# EAGLE design Motor_Driver_Play (EAGLE 7.4.0)
DATABASE: C:\EAGLE-7.2.0\ulp\bom-ex164
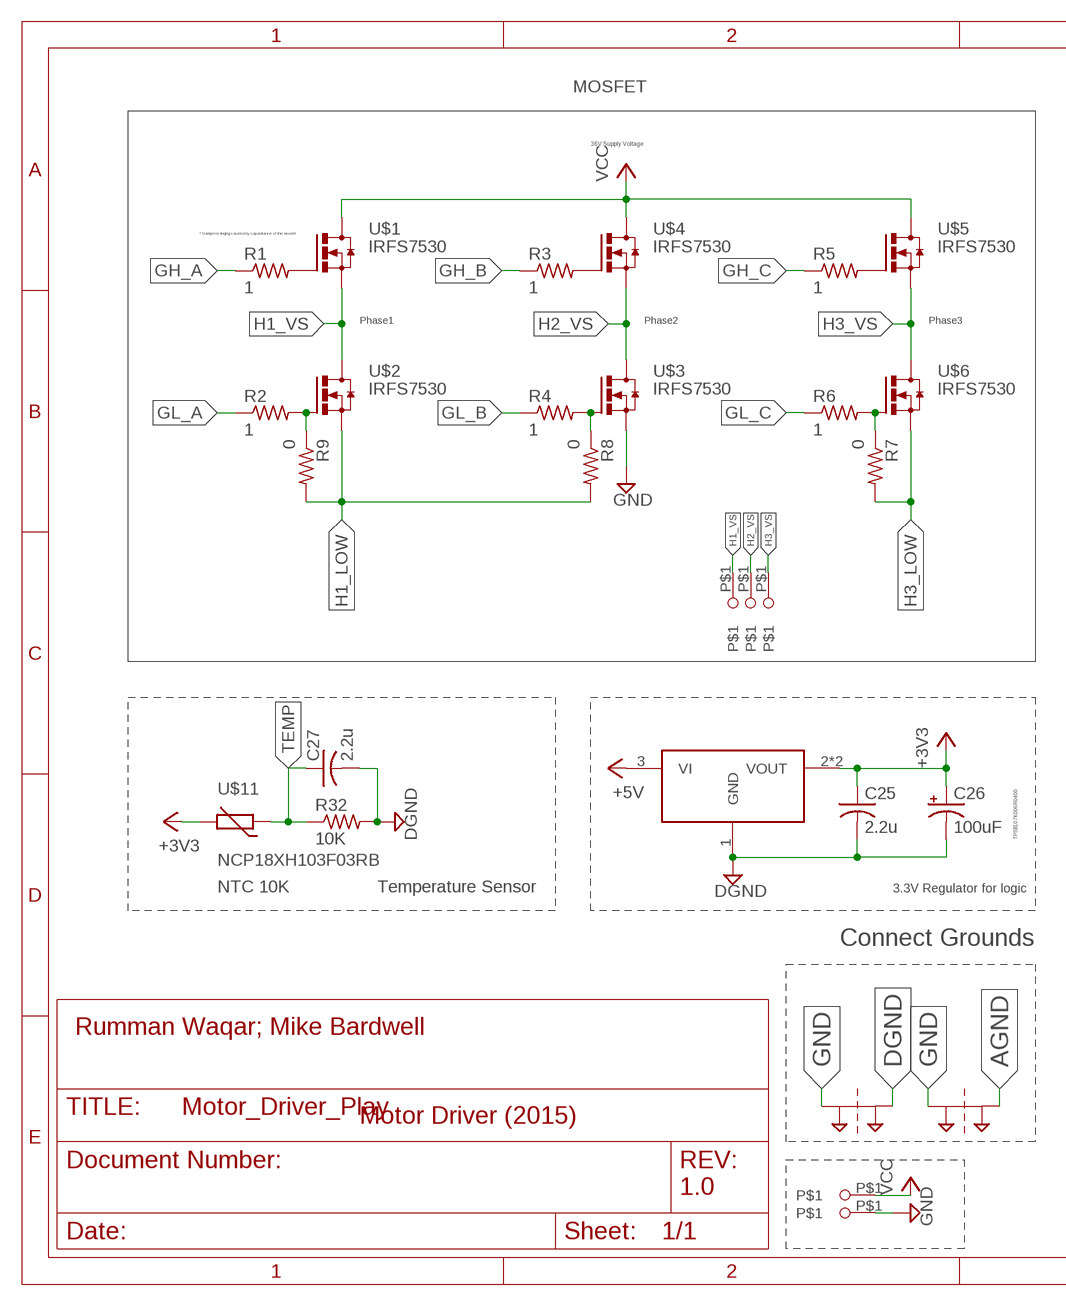
[diagram p0: schematic, sheet 1, part 1 of 2]
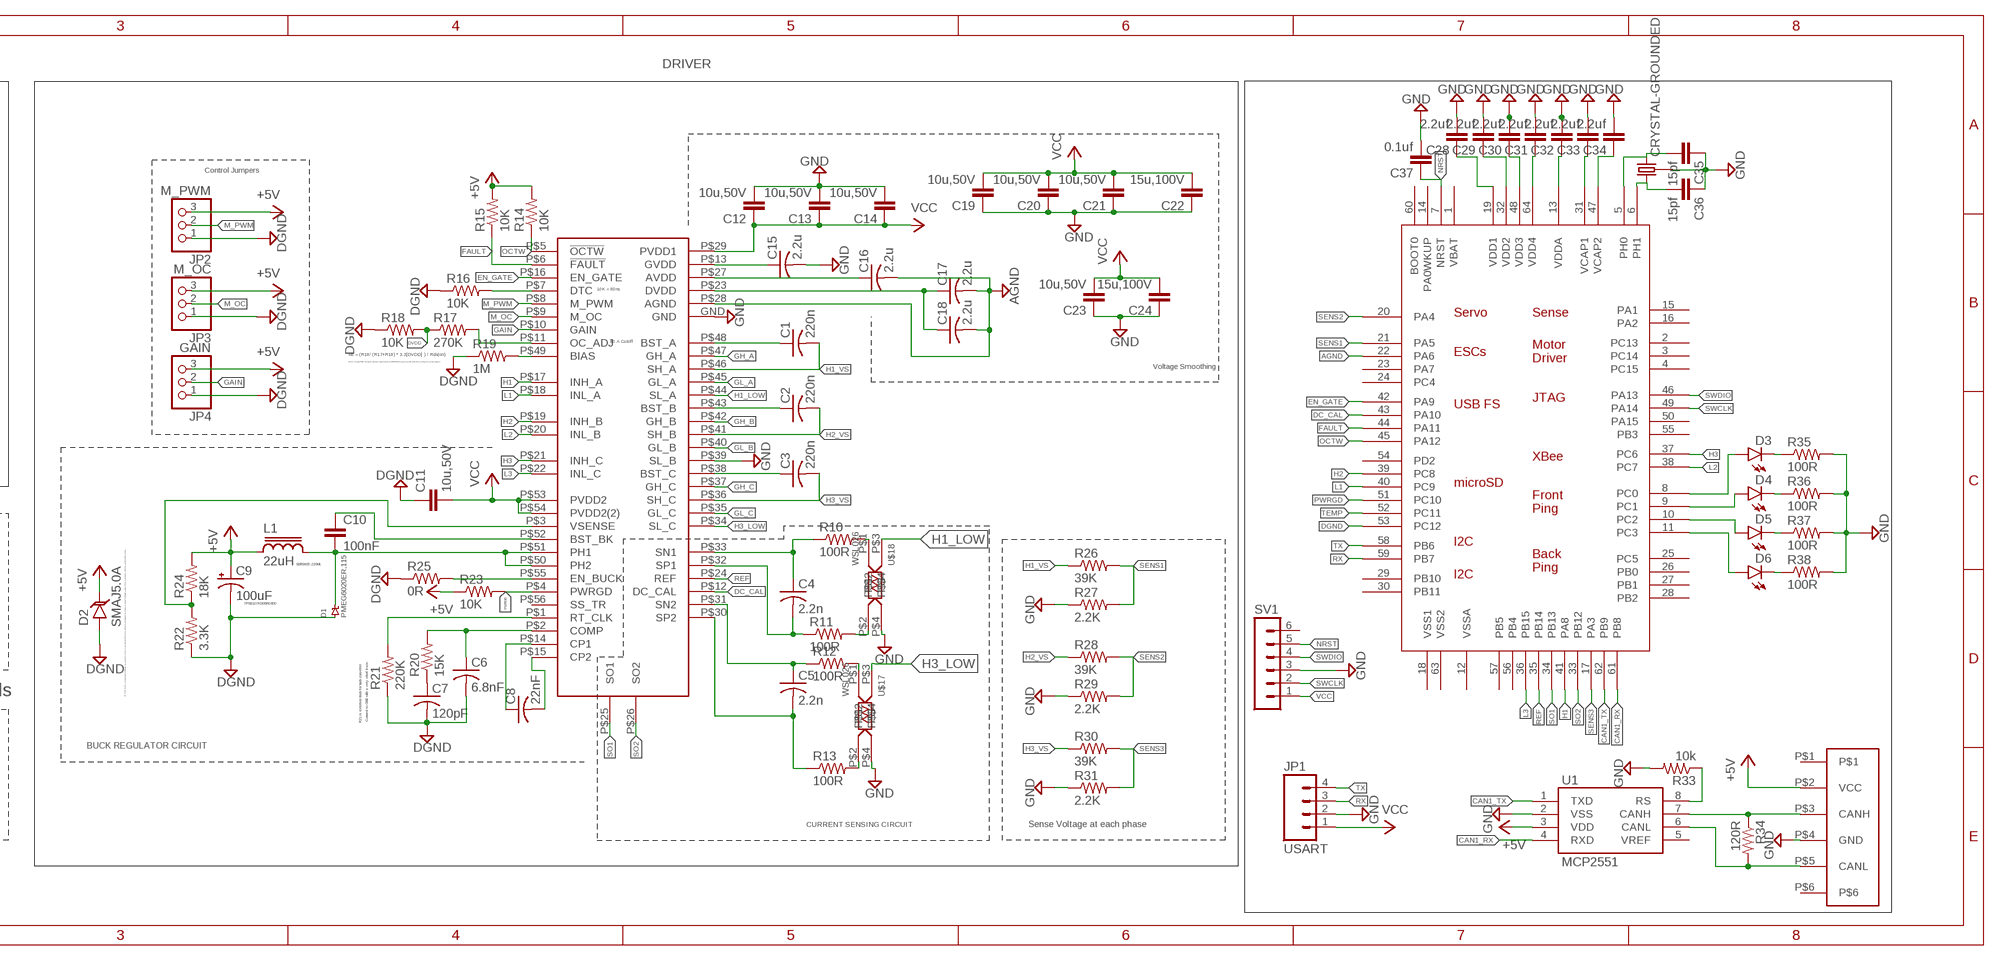
[diagram p1: schematic, sheet 1, part 2 of 2]

## Parts
C1  220n  C-USC0805  [C0805]
C2  220n  C-USC0805  [C0805]
C3  220n  C-USC0805  [C0805]
C4  2.2n  C-USC0603  [C0603]
C5  2.2n  C-USC0603  [C0603]
C6  6.8nF  C-USC0603  [C0603]
C7  120pF  C-USC0603  [C0603]
C8  22nF  C-USC0603  [C0603]
C9  100uF  CAP_POL3528-KIT  [EIA3528-KIT]
C10  100nF  CAP0805  [0805]
C11  10u,50V  CAP1206  [1206]
C12  10u,50V  CAP1206  [1206]
C13  10u,50V  CAP1206  [1206]
C14  10u,50V  CAP1206  [1206]
C15  2.2u  C-USC0805  [C0805]
C16  2.2u  C-USC0805  [C0805]
C17  2.2u  C-USC0805  [C0805]
C18  2.2u  C-USC0805  [C0805]
C19  10u,50V  CAP1206  [1206]
C20  10u,50V  CAP1206  [1206]
C21  10u,50V  CAP1206  [1206]
C22  15u,100V  C-EUC2220K  [C2220K]
C23  10u,50V  CAP1206  [1206]
C24  15u,100V  C-EUC2220K  [C2220K]
C25  2.2u  C-USC0805  [C0805]
C26  100uF  CAP_POL3528-KIT  [EIA3528-KIT]
C27  2.2u  C-USC0805  [C0805]
C28  2.2uf  CAP0603-CAP  [0603-CAP]
C29  2.2uf  CAP0603-CAP  [0603-CAP]
C30  2.2uf  CAP0603-CAP  [0603-CAP]
C31  2.2uf  CAP0603-CAP  [0603-CAP]
C32  2.2uf  CAP0603-CAP  [0603-CAP]
C33  2.2uf  CAP0603-CAP  [0603-CAP]
C34  2.2uf  CAP0603-CAP  [0603-CAP]
C35  15pf  CAP0603-CAP  [0603-CAP]
C36  15pf  CAP0603-CAP  [0603-CAP]
C37  0.1uf  CAP0603-CAP  [0603-CAP]
D1  PMEG6020ER,115  DIODE[SCHOTKY]-SOD123W  [SOD123W]
D2  SMAJ5.0A  TVSSMA  [SMA-DIODE]
D3  LED0603  [LED-0603]
D4  LED0603  [LED-0603]
D5  LED0603  [LED-0603]
D6  LED0603  [LED-0603]
JP1  USART  M04PTH  [1X04]
JP2  M_PWM  PINHD-1X3  [1X03]
JP3  M_OC  PINHD-1X3  [1X03]
JP4  GAIN  PINHD-1X3  [1X03]
L1  22uH  SDR0805  [SDR0805]
PT1  2PT_GND_TIE  [2PT_GND_TIE]
PT2  2PT_GND_TIE  [2PT_GND_TIE]
R1  1  R-US_R0603  [R0603]
R2  1  R-US_R0603  [R0603]
R3  1  R-US_R0603  [R0603]
R4  1  R-US_R0603  [R0603]
R5  1  R-US_R0603  [R0603]
R6  1  R-US_R0603  [R0603]
R7  0  R-US_R0603  [R0603]
R8  0  R-US_R0603  [R0603]
R9  0  R-US_R0603  [R0603]
R10  100R  R-US_R0603  [R0603]
R11  100R  R-US_R0603  [R0603]
R12  100R  R-US_R0603  [R0603]
R13  100R  R-US_R0603  [R0603]
R14  10K  R-US_R0603  [R0603]
R15  10K  R-US_R0603  [R0603]
R16  10K  R-US_R0603  [R0603]
R17  270K  R-US_R0603  [R0603]
R18  10K  R-US_R0603  [R0603]
R19  1M  R-US_R0603  [R0603]
R20  15K  R-US_R0603  [R0603]
R21  220K  R-US_R0603  [R0603]
R22  3.3K  R-US_R0603  [R0603]
R23  10K  R-US_R0603  [R0603]
R24  18K  R-US_R0603  [R0603]
R25  0R  R-US_R0603  [R0603]
R26  39K  R-US_R0805  [R0805]
R27  2.2K  R-US_R0805  [R0805]
R28  39K  R-US_R0805  [R0805]
R29  2.2K  R-US_R0805  [R0805]
R30  39K  R-US_R0805  [R0805]
R31  2.2K  R-US_R0805  [R0805]
R32  10K  R-US_M0805  [M0805]
R33  10k  R-US_R0603  [R0603]
R34  120R  R-US_R0603  [R0603]
R35  100R  R-US_R0603  [R0603]
R36  100R  R-US_R0603  [R0603]
R37  100R  R-US_R0603  [R0603]
R38  100R  R-US_R0603  [R0603]
SV1  MA06-1  [MA06-1]
U1  MCP2551  [SO08]
U$1  IRFS7530  IRFS7530_HEATSINK  [IRF7530_HEATSINK]
U$2  IRFS7530  IRFS7530_HEATSINK  [IRF7530_HEATSINK]
U$3  IRFS7530  IRFS7530_HEATSINK  [IRF7530_HEATSINK]
U$4  IRFS7530  IRFS7530_HEATSINK  [IRF7530_HEATSINK]
U$5  IRFS7530  IRFS7530_HEATSINK  [IRF7530_HEATSINK]
U$6  IRFS7530  IRFS7530_HEATSINK  [IRF7530_HEATSINK]
U$7  DRV8302  [DRV8302]
U$8  STM32F4R_64PIN_FOXCAR  [LQFP64]
U$9  CRYSTAL-GROUNDED  [CRYSTAL-SMD-5X3]
U$10  TC2117  [SOT223]
U$11  NCP18XH103F03RB  [R0603]
U$12  1CONN_SOLDER  [1CONN_PAD]
U$13  1CONN_SOLDER  [1CONN_PAD]
U$14  1CONN_SOLDER  [1CONN_PAD]
U$15  1CONN_SOLDER  [1CONN_PAD]
U$16  1CONN_SOLDER  [1CONN_PAD]
U$17  WSL026  [REEL]
U$18  WSL026  [REEL]
U$19  CAN_6P6C  [CAN_6P6C]

## Nets
+3V3: C25.1 C26.A(+) U$10.2(VOUT) U$10.4(VOUT) U$11.2
+5V: C9.A(+) D2.C JP2.3 JP3.3 JP4.3 L1.1 R14.2 R15.2 R23.1 R24.2 U1.3(VDD) U$10.3(VI) U$19.P$2(VCC)
AGND: C16.2 C17.2 C18.2 PT2.P$2 U$7.P$28(AGND) U$8.22(PA6)
CAN1_RX: U1.4(RXD) U$8.61(PB8)
CAN1_TX: U1.1(TXD) U$8.62(PB9)
DC_CAL: U$7.P$12(DC_CAL) U$8.43(PA10)
DGND: C6.2 C7.2 C9.C(-) C11.1 C25.2 C26.C(-) C27.2 D1.P$1 D2.A JP2.1 JP3.1 JP4.1 PT1.P$2 R16.1 R18.1 R19.1 R21.1 R22.1 R25.1 R32.2 U$8.53(PC12) U$10.1(GND)
DVDD: R17.1 R18.2
EN_GATE: U$7.P$16(EN_GATE) U$8.42(PA9)
FAULT: R15.1 U$7.P$6(!FAULT) U$8.44(PA11)
GAIN: JP4.2 U$7.P$10(GAIN)
GH_A: R1.1 U$7.P$47(GH_A)
GH_B: R3.1 U$7.P$42(GH_B)
GH_C: R5.1 U$7.P$37(GH_C)
GL_A: R2.1 U$7.P$45(GL_A)
GL_B: R4.1 U$7.P$40(GL_B)
GL_C: R6.1 U$7.P$35(GL_C)
GND: C12.2 C13.2 C14.2 C15.2 C19.1 C20.1 C21.1 C22.1 C23.1 C24.1 C28.2 C29.2 C30.2 C31.2 C32.2 C33.2 C34.2 C35.1 C36.1 C37.2 JP1.2 PT1.P$1 PT2.P$1 R27.1 R29.1 R31.1 R33.2 R35.2 R36.2 R37.2 R38.2 SV1.3 U1.2(VSS) U$3.S1(S) U$3.S2(S) U$3.S3(S) U$3.S4(S) U$3.S5(S) U$7.GND U$7.P$39(SL_B) U$9.2 U$9.4 U$16.P$1 U$17.P$4 U$18.P$4 U$19.P$4(GND)
H1: U$7.P$17(INH_A) U$8.41(PA8)
H1_LOW: R8.2 R9.2 U$2.S1(S) U$2.S2(S) U$2.S3(S) U$2.S4(S) U$2.S5(S) U$7.P$44(SL_A) U$18.P$3
H1_VS: C1.2 R26.1 U$1.S1(S) U$1.S2(S) U$1.S3(S) U$1.S4(S) U$1.S5(S) U$2.D1(D) U$7.P$46(SH_A) U$14.P$1
H2: U$7.P$19(INH_B) U$8.39(PC8)
H2_VS: C2.2 R28.1 U$3.D1(D) U$4.S1(S) U$4.S2(S) U$4.S3(S) U$4.S4(S) U$4.S5(S) U$7.P$41(SH_B) U$13.P$1
H3: U$7.P$21(INH_C) U$8.37(PC6)
H3_LOW: R7.2 U$6.S1(S) U$6.S2(S) U$6.S3(S) U$6.S4(S) U$6.S5(S) U$7.P$34(SL_C) U$17.P$3
H3_VS: C3.2 R30.1 U$5.S1(S) U$5.S2(S) U$5.S3(S) U$5.S4(S) U$5.S5(S) U$6.D1(D) U$7.P$36(SH_C) U$12.P$1
L1: U$7.P$18(INL_A) U$8.40(PC9)
L2: U$7.P$20(INL_B) U$8.38(PC7)
L3: U$7.P$22(INL_C) U$8.36(PB15)
M_OC: JP3.2 U$7.P$9(M_OC)
M_PWM: JP2.2 U$7.P$8(M_PWM)
N$1: R1.2 U$1.G1(G)
N$2: R2.2 R9.1 U$2.G1(G)
N$3: R4.2 R8.1 U$3.G1(G)
N$4: R3.2 U$4.G1(G)
N$5: R5.2 U$5.G1(G)
N$6: R6.2 R7.1 U$6.G1(G)
N$7: C1.1 U$7.P$48(BST_A)
N$8: R17.2 U$7.P$11(OC_ADJ)
N$9: R10.2 U$18.P$1
N$10: C8.1 U$7.P$14(CP1)
N$11: C5.2 R13.1 U$7.P$30(SP2)
N$12: C2.1 U$7.P$43(BST_B)
N$13: C8.2 U$7.P$15(CP2)
N$14: C7.1 R20.1
N$15: R21.2 U$7.P$1(RT_CLK)
N$16: R16.2 U$7.P$7(DTC)
N$17: R25.2 U$7.P$55(EN_BUCK)
N$18: C15.1 U$7.P$13(GVDD)
N$19: C10.2 D1.P$2 L1.2 U$7.P$50(PH2) U$7.P$51(PH1)
N$20: C6.1 R20.2 U$7.P$2(COMP)
N$21: R19.2 U$7.P$49(BIAS)
N$22: C4.1 R10.1 U$7.P$33(SN1)
N$23: C4.2 R11.1 U$7.P$32(SP1)
N$24: C5.1 R12.1 U$7.P$31(SN2)
N$25: R12.2 U$17.P$1
N$26: C3.1 U$7.P$38(BST_C)
N$27: C16.1 U$7.P$27(AVDD)
N$28: R22.2 R24.1 U$7.P$3(VSENSE)
N$29: C10.1 U$7.P$52(BST_BK)
N$30: C17.1 C18.1 U$7.P$23(DVDD)
N$31: R13.2 U$17.P$2
N$32: C28.1 U$8.19(VDD1)
N$33: R11.2 U$18.P$2
N$34: C29.1 U$8.32(VDD2)
N$35: C30.1 U$8.48(VDD3)
N$36: C31.1 U$8.64(VDD4)
N$37: C32.1 U$8.13(VDDA)
N$38: C33.1 U$8.31(VCAP1)
N$39: C34.1 U$8.47(VCAP2)
N$40: C35.2 U$8.5(PH0) U$9.1
N$41: C36.2 U$8.6(PH1) U$9.3
N$42: R33.1 U1.8(RS)
N$43: R34.1 U1.7(CANH) U$19.P$3(CANH)
N$44: R34.2 U1.6(CANL) U$19.P$5(CANL)
N$45: D3.A U$8.8(PC0)
N$46: D4.A U$8.9(PC1)
N$47: D5.A U$8.10(PC2)
N$48: D6.A U$8.11(PC3)
N$49: D6.C R38.1
N$50: D5.C R37.1
N$51: D4.C R36.1
N$52: D3.C R35.1
NRST: C37.1 SV1.5 U$8.7(NRST)
OCTW: R14.1 U$7.P$5(!OCTW) U$8.45(PA12)
PWRGD: R23.2 U$7.P$4(PWRGD) U$8.51(PC10)
REF: U$7.P$24(REF) U$8.35(PB14)
RX: JP1.3 U$8.59(PB7)
SENS1: R26.2 R27.2 U$8.21(PA5)
SENS2: R28.2 R29.2 U$8.20(PA4)
SENS3: R30.2 R31.2 U$8.17(PA3)
SO1: U$7.P$25(SO1) U$8.34(PB13)
SO2: U$7.P$26(SO2) U$8.33(PB12)
SWCLK: SV1.2 U$8.49(PA14)
SWDIO: SV1.4 U$8.46(PA13)
TEMP: C27.1 R32.1 U$8.52(PC11) U$11.1
TX: JP1.4 U$8.58(PB6)
VCC: C11.2 C12.1 C13.1 C14.1 C19.2 C20.2 C21.2 C22.2 C23.2 C24.2 JP1.1 SV1.1 U$1.D1(D) U$4.D1(D) U$5.D1(D) U$7.P$29(PVDD1) U$7.P$53(PVDD2) U$7.P$54(PVDD2(2)) U$15.P$1
Unconnected: SV1.6 U1.5(VREF) U$7.P$56(SS_TR) U$8.1(VBAT) U$8.2(PC13) U$8.3(PC14) U$8.4(PC15) U$8.12(VSSA) U$8.14(PA0WKUP) U$8.15(PA1) U$8.16(PA2) U$8.18(VSS1) U$8.23(PA7) U$8.24(PC4) U$8.25(PC5) U$8.26(PB0) U$8.27(PB1) U$8.28(PB2) U$8.29(PB10) U$8.30(PB11) U$8.50(PA15) U$8.54(PD2) U$8.55(PB3) U$8.56(PB4) U$8.57(PB5) U$8.60(BOOT0) U$8.63(VSS2) U$19.P$1 U$19.P$6

## Notes on the sheet
- MOSFET | DRIVER
- 36V Supply Voltage
- * Dampens ringing caused by capacitance of the mosfet | Control Jumpers
- Phase1 | Phase2 | Phase3
- 10K = 80ns
- 90 A Cutoff
- Ioc = (R18/ (R17+R18) * 3.3[DVDD] ) / Rds(on)
- Don't mount R18, because internal current limit of DRV8302 doesn't work with this config for some reason
- Voltage Smoothing
- SDR0805-220ML
- TPSB107K006R0400
- TPSB107K006R0400
- NTC 10K | Temperature Sensor | 3.3V Regulator for logic
- Connect Grounds | A TVS diode, or transient voltage suppression diode, is an electrical device which is designed to divert or shunt voltage spikes from a circuit in order to protect that circuit.
- R21 is external clock for buck converter. | Connect to GND with a very short trace.
- BUCK REGULATOR CIRCUIT
- Rumman Waqar; Mike Bardwell
- Motor Driver (2015) | CURRENT SENSING CIRCUIT | Sense Voltage at each phase
- 1.0

## Library data of the parts
C1-C8 C15-C18 C25 C27 = adafruit:C-US: CAPACITOR, American symbol
C9 C26 = SparkFun-Capacitors:CAP_POL: Capacitor Polarized These are standard SMD and PTH capacitors. Normally 10uF, 47uF, and 100uF in electrolytic and tantalum varieties. Always verify the external diameter of the through hole cap, it varies with capacity, voltage, and manufacturer. The EIA devices should be standard.
C10-C14 C19-C21 C23 = SparkFun-Passives:CAP: Capacitor Standard 0603 ceramic capacitor, and 0.1" leaded capacitor.
C22 C24 = resistor:C-EU: CAPACITOR, European symbol
C28-C37 = SparkFun-Capacitors:CAP: Capacitor Standard 0603 ceramic capacitor, and 0.1" leaded capacitor.
D1 = nxp:DIODE[SCHOTKY]
D2 = SparkFun-DiscreteSemi:TVS: Transient voltage suppressor- prevents ESD on inputs.
D3-D6 = SparkFun-LED:LED: LEDs Standard schematic elements and footprints for 5mm, 3mm, 1206, and 0603 sized LEDs. 5mm - Spark Fun Electronics SKU : COM-00529 (and others)
JP1 = SparkFun-Connectors:M04: Header 4 Standard 4-pin 0.1" header. Use with straight break away headers (SKU : PRT-00116), right angle break away headers (PRT-00553), swiss pins (PRT-00743), machine pins (PRT-00117), and female headers (PRT-00115). Molex polarized connector foot print use with SKU : PRT-08231 with associated crimp pins and housings. 1MM SMD Version SKU: PRT-10208
JP2-JP4 = pinhead:PINHD-1X3: PIN HEADER
L1 = bourne:SDR0805: POWER INDUCTOR
PT1 PT2 = SparkFun-Passives:2PT_GND_TIE: Package for connecting two ground nets in one place.
R1-R38 = adafruit:R-US_: RESISTOR, American symbol
SV1 = con-lstb:MA06-1: PIN HEADER; OC_FARNELL: unknown; OC_NEWARK: unknown
U1 = SparkFun-DigitalIC:MCP2551: CAN transceiver; PROD_ID: IC-09907
U$1-U$6 = bldc_lib:IRFS7530_HEATSINK: IRFS7530 with Heatsink
U$7 = bldc_lib:DRV8302: DRV8302 3-Phase Brushless Motor Pre-Driver with Dual Current Sense Amps and Buck Converter (PWM Ctrl)
U$8 = stm32f4:STM32F4R_64PIN_FOXCAR: 64-pin STM32F4 chip with symbol for Foxcar Control Board v1.
U$9 = SparkFun-FreqCtrl:CRYSTAL-GROUNDED
U$10 = bldc_lib:TC2117
U$11 = bldc_lib:NCP18XH103F03RB: NTC Thermistor NTC Thermistors 10K OHM 1%
U$12-U$16 = bldc_lib:1CONN_SOLDER
U$17 U$18 = WSL:WSL026
U$19 = Shell2015:CAN_6P6C: Digikey part: 553-2258-ND; PARTNO: 553-2258-ND

## Board
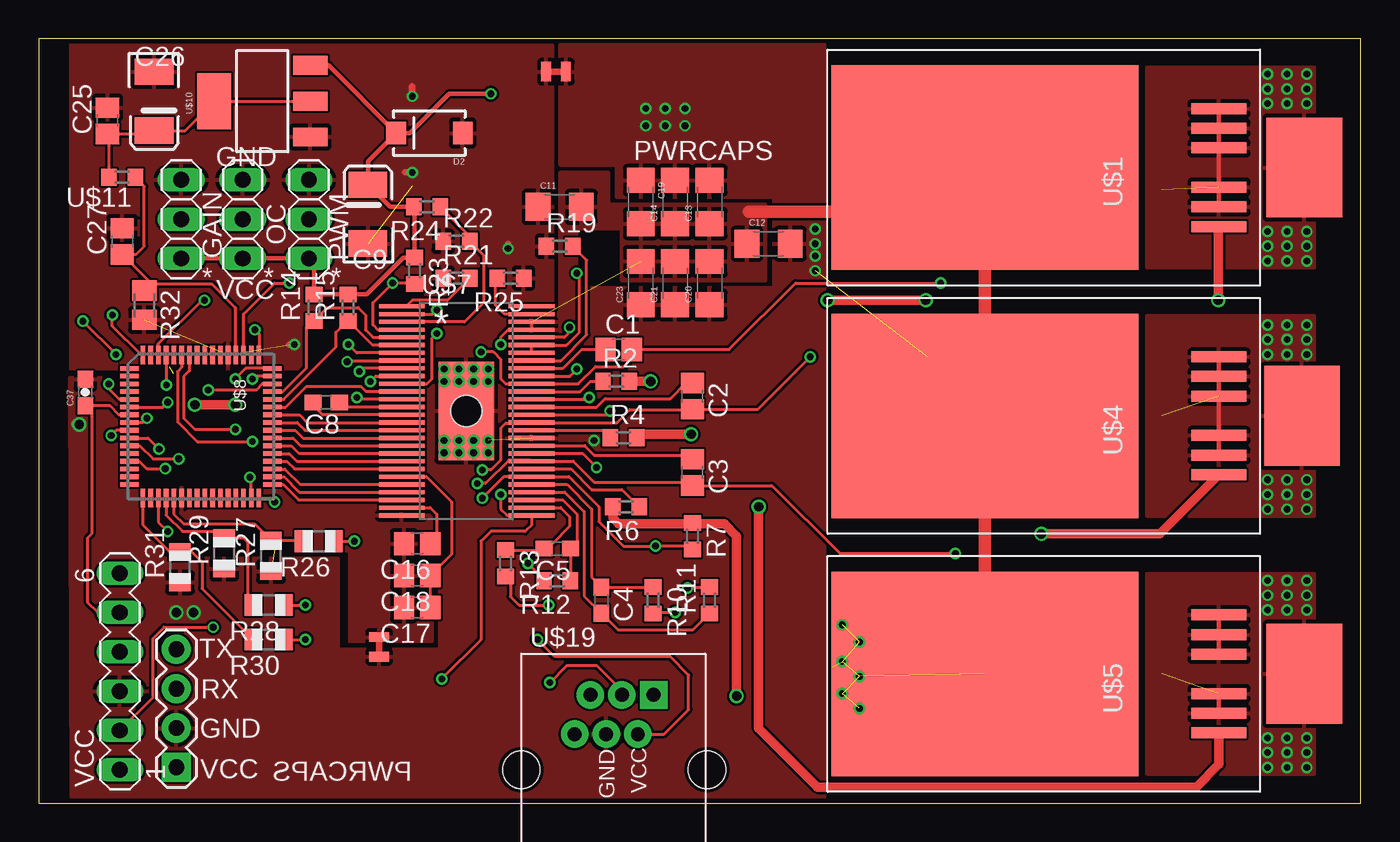
[diagram p2: board, top side]
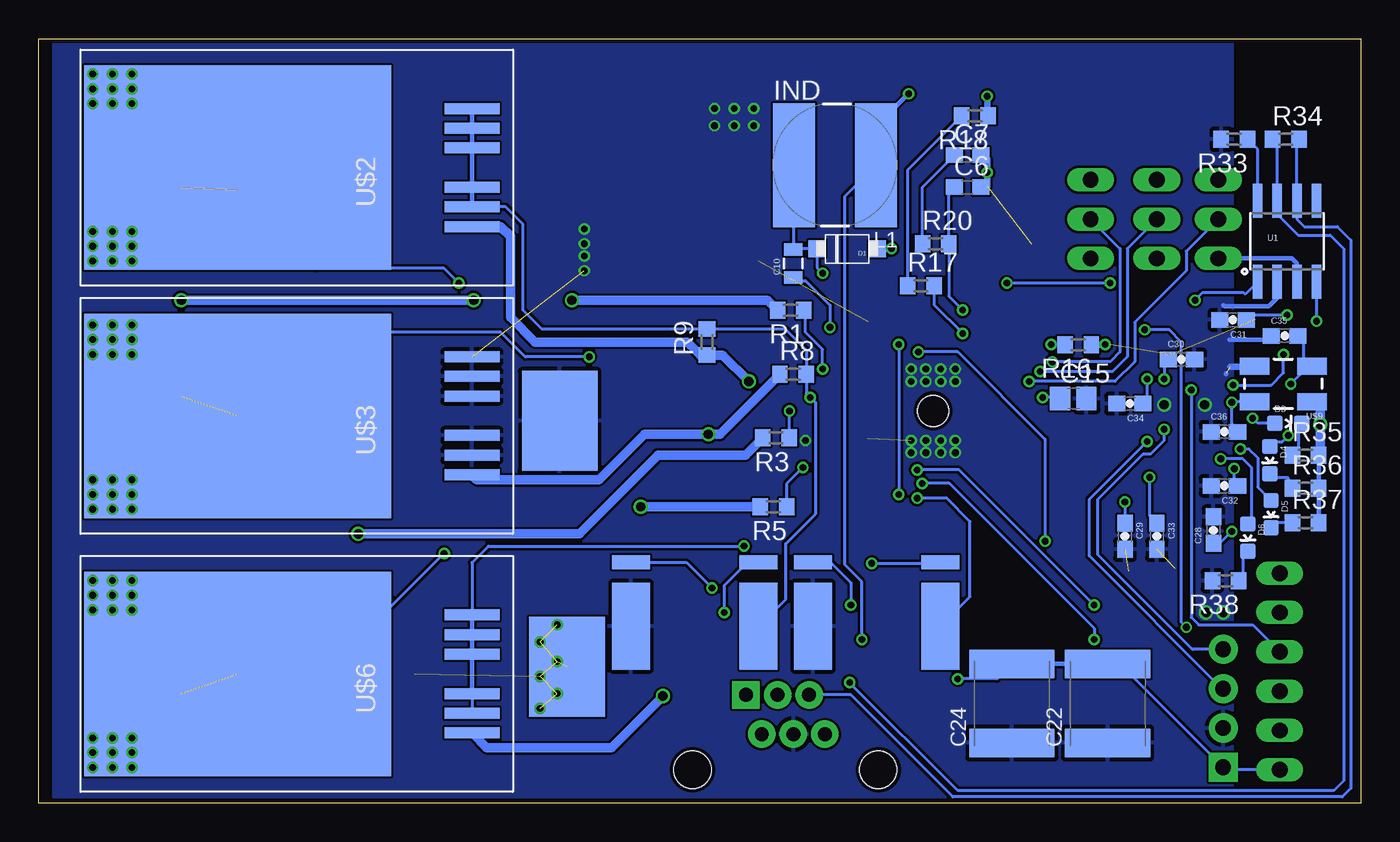
[diagram p3: board, bottom side, seen from below]

Size 85.41 x 49.36 mm. Coordinates in mm from the lower left corner, seen from the top.
Outline: 0,0 85.41,0 85.41,49.36 0,49.36 0,0
Copper layers (1*16): Top 0.035mm / dielectric 1.5mm / Bottom 0.035mm
Design rules "ITEADstudio_DRC": minimum track width 6mil, minimum drill 12mil, track to track 6mil, track to pad 6mil, pad to pad 6mil, via to via 6mil, smd to smd 0mil, copper to edge 10mil, drill to drill 10mil, minimum pad ring 10mil, minimum via ring 6mil, stop-mask expansion 2mil, vias tented up to drill 100mil, thermal gap 10mil

### Footprints (pad centres in the part's own frame; a part is rotated, then mirrored left to right if it is on the bottom)
C0805 = smd 1.3 x 1.5: 1 -0.85,0; 2 0.85,0
C0603 = smd 1.1 x 1: 1 -0.85,0; 2 0.85,0
EIA3528-KIT = smd 1.7 x 2.5: A 1.9,0; C -1.9,0
0805 = smd 0.8 x 1.2: 1 -0.9,0; 2 0.9,0
1206 = smd 1.6 x 1.8: 1 -1.4,0; 2 1.4,0
C2220K = smd 1.85 x 5.5: 1 -2.55,0; 2 2.55,0
0603-CAP = smd 1.1 x 1: 1 -0.85,0; 2 0.85,0
SOD123W = smd 1.1 x 1.1: P$1 -1.95,0; P$2 1.95,0
SMA-DIODE = smd 1.27 x 1.47: A -2.15,0; C 2.15,0
LED-0603 = smd 1 x 1: A 0,-0.877; C 0,0.877
1X04 = drill 1.016 pad 1.88 square: 1 0,0 | drill 1.016 pad 1.88: 2 2.54,0; 3 5.08,0; 4 7.62,0
1X03 = drill 1.016 long: 1 -2.54,0; 2 0,0; 3 2.54,0
SDR0805 = smd 2.7 x 8: 1 -2.65,0; 2 2.65,0
2PT_GND_TIE = smd 1.27 x 0.635: P$1 0,0.635; P$2 0,-0.635
R0603 = smd 1 x 1.1: 1 -0.85,0; 2 0.85,0
R0805 = smd 1.1 x 1.4: 1 -1,0; 2 1,0
M0805 = smd 1.3 x 1.6: 1 -0.95,0; 2 0.95,0
MA06-1 = drill 1.016 long: 1 -6.35,0; 2 -3.81,0; 3 -1.27,0; 4 1.27,0; 5 3.81,0; 6 6.35,0
SO08 = smd 0.61 x 2.21: 1 -1.905,-2.616; 2 -0.635,-2.616; 3 0.635,-2.616; 4 1.905,-2.616; 5 1.905,2.616; 6 0.635,2.616; 7 -0.635,2.616; 8 -1.905,2.616
IRF7530_HEATSINK = smd 13.208 x 19.812: D1 0,1.27 | smd 0.711 x 3.556: G1 -3.81,-13.856; S1 -2.54,-13.856; S2 -1.27,-13.856; S3 1.27,-13.856; S4 2.54,-13.856; S5 3.81,-13.856
DRV8302 = smd 3.61 x 6.35: GND 0,0 | smd 2.94 x 0.27: P$1 -4.167,6.75; P$2 -4.167,6.25; P$3 -4.167,5.75; P$4 -4.167,5.25; P$5 -4.167,4.75; P$6 -4.167,4.25; P$7 -4.167,3.75; P$8 -4.167,3.25; P$9 -4.167,2.75; P$10 -4.167,2.25; P$11 -4.167,1.75; P$12 -4.167,1.25; P$13 -4.167,0.75; P$14 -4.167,0.25; P$15 -4.167,-0.25; P$16 -4.167,-0.75; P$17 -4.167,-1.25; P$18 -4.167,-1.75; P$19 -4.167,-2.25; P$20 -4.167,-2.75; P$21 -4.167,-3.25; P$22 -4.167,-3.75; P$23 -4.167,-4.25; P$24 -4.167,-4.75; P$25 -4.167,-5.25; P$26 -4.167,-5.75; P$27 -4.167,-6.25; P$28 -4.167,-6.75; P$29 4.217,-6.75; P$30 4.217,-6.25; P$31 4.217,-5.75; P$32 4.217,-5.25; P$33 4.217,-4.75; P$34 4.217,-4.25; P$35 4.217,-3.75; P$36 4.217,-3.25; P$37 4.217,-2.75; P$38 4.217,-2.25; P$39 4.217,-1.75; P$40 4.217,-1.25; P$41 4.217,-0.75; P$42 4.217,-0.25; P$43 4.217,0.25; P$44 4.217,0.75; P$45 4.217,1.25; P$46 4.217,1.75; P$47 4.217,2.25; P$48 4.217,2.75; P$49 4.217,3.25; P$50 4.217,3.75; P$51 4.217,4.25; P$52 4.217,4.75; P$53 4.217,5.25; P$54 4.217,5.75; P$55 4.217,6.25; P$56 4.217,6.75 | hole 2: 0,0
LQFP64 = smd 0.3 x 1.2: 1 -3.7,-4.3; 2 -3.2,-4.3; 3 -2.7,-4.3; 4 -2.2,-4.3; 5 -1.7,-4.3; 6 -1.2,-4.3; 7 -0.7,-4.3; 8 -0.2,-4.3; 9 0.3,-4.3; 10 0.8,-4.3; 11 1.3,-4.3; 12 1.8,-4.3; 13 2.3,-4.3; 14 2.8,-4.3; 15 3.3,-4.3; 16 3.8,-4.3; 33 3.8,4.95; 34 3.3,4.95; 35 2.8,4.95; 36 2.3,4.95; 37 1.8,4.95; 38 1.3,4.95; 39 0.8,4.95; 40 0.3,4.95; 41 -0.2,4.95; 42 -0.7,4.95; 43 -1.2,4.95; 44 -1.7,4.95; 45 -2.2,4.95; 46 -2.7,4.95; 47 -3.2,4.95; 48 -3.7,4.95 | smd 1.2 x 0.3: 17 4.675,-3.425; 18 4.675,-2.925; 19 4.675,-2.425; 20 4.675,-1.925; 21 4.675,-1.425; 22 4.675,-0.925; 23 4.675,-0.425; 24 4.675,0.075; 25 4.675,0.575; 26 4.675,1.075; 27 4.675,1.575; 28 4.675,2.075; 29 4.675,2.575; 30 4.675,3.075; 31 4.675,3.575; 32 4.675,4.075; 49 -4.575,4.075; 50 -4.575,3.575; 51 -4.575,3.075; 52 -4.575,2.575; 53 -4.575,2.075; 54 -4.575,1.575; 55 -4.575,1.075; 56 -4.575,0.575; 57 -4.575,0.075; 58 -4.575,-0.425; 59 -4.575,-0.925; 60 -4.575,-1.425; 61 -4.575,-1.925; 62 -4.575,-2.425; 63 -4.575,-2.925; 64 -4.575,-3.425
CRYSTAL-SMD-5X3 = smd 1.9 x 1.1: 1 -1.85,-1.15; 2 1.85,-1.15; 3 1.85,1.15; 4 -1.85,1.15
SOT223 = smd 1.219 x 2.235: 1 -2.311,-3.099; 2 0,-3.099; 3 2.311,-3.099 | smd 3.6 x 2.2: 4 0,3.099
1CONN_PAD = smd 6.452 x 4.877: P$1 0,0
REEL = smd 2.438 x 0.889: P$1 4.115,3.239; P$2 -4.115,3.239 | smd 2.438 x 5.588: P$3 4.115,-0.889; P$4 -4.115,-0.889
CAN_6P6C = drill 0.9 pad 1.778 square: P$1 4.08,0 | drill 0.9 pad 1.778: P$2 3.06,-2.54; P$3 2.04,0; P$4 1.02,-2.54; P$5 0,0; P$6 -1.02,-2.54 | hole 2.4: -4.47,-4.84; 7.53,-4.84

### Placement (x,y rotation side)
C1  37.47,29.29 0 top
C2  42.23,26.27 270 top
C3  42.23,21.35 270 top
C4  36.35,13.1 270 top
C5  33.5,16.43 180 top
C6  25.4,39.77 0 bottom
C7  25.4,41.83 0 bottom
C8  18.57,25.88 180 top
C9  21.27,38.02 90 top
C10  36.67,34.85 90 bottom
C11  33.66,38.5 0 top
C12  47.15,36.12 0 top
C13  43.34,38.81 90 top
C14  41.12,38.81 90 top
C15  18.57,26.11 0 bottom
C16  24.45,16.75 180 top
C17  24.45,12.62 180 top
C18  24.45,14.68 180 top
C19  38.89,38.81 270 top
C20  43.34,33.58 90 top
C21  41.12,33.58 90 top
C22  16.35,6.43 90 bottom
C23  38.89,33.58 90 top
C24  22.54,6.43 90 bottom
C25  4.45,44.05 90 top
C26  7.46,45.32 270 top
C27  5.4,36.27 90 top
C28  9.53,17.62 90 bottom
C29  15.24,17.22 270 bottom
C30  11.59,28.65 0 bottom
C31  8.26,31.19 180 bottom
C32  8.81,20.48 180 bottom
C33  13.18,17.22 270 bottom
C34  14.92,25.8 180 bottom
C35  4.92,30.16 0 bottom
C36  8.81,23.97 0 bottom
C37  3.02,26.51 90 top
D1  33.18,35.8 180 bottom
D2  25.24,43.26 180 top
D3  4.68,24.53 270 bottom
D4  5.87,22.15 180 bottom
D5  5.79,18.65 180 bottom
D6  7.3,17.14 180 bottom
JP1  8.89,2.3 90 top
JP2  17.46,37.7 270 top
JP3  13.18,37.7 270 top
JP4  9.21,37.7 270 top
L1  33.97,41.2 180 bottom
PT1  33.42,47.23 270 top
PT2  21.99,10.08 180 top
R1  36.83,31.83 180 bottom
R2  37.31,27.23 0 top
R3  37.78,23.57 180 bottom
R4  37.78,23.57 0 top
R5  37.94,19.13 180 bottom
R6  37.94,19.13 180 top
R7  42.23,17.22 270 top
R8  36.67,27.7 0 bottom
R9  42.23,29.77 90 bottom
R10  39.69,13.1 270 top
R11  43.34,13.1 90 top
R12  33.5,14.37 180 top
R13  30.16,15.48 270 top
R14  17.78,31.99 90 top
R15  20,31.99 90 top
R16  18.26,29.61 180 bottom
R17  28.42,33.42 0 bottom
R18  24.92,44.37 180 bottom
R19  33.66,35.96 0 top
R20  27.46,36.12 0 bottom
R21  26.99,33.89 0 top
R22  26.99,36.27 0 top
R23  24.29,34.37 270 top
R24  25.08,38.5 180 top
R25  30.48,33.89 180 top
R26  18.1,16.91 180 top
R27  15,15.95 90 top
R28  14.84,12.78 180 top
R29  11.99,16.11 90 top
R30  14.84,10.56 180 top
R31  9.13,15.24 90 top
R32  6.83,32.15 270 top
R33  8.18,42.86 180 bottom
R34  4.84,42.86 0 bottom
R35  3.57,22.46 0 bottom
R36  3.57,20.32 0 bottom
R37  3.57,18.1 0 bottom
R38  8.73,14.37 180 bottom
SV1  5.24,8.49 90 top
U1  4.76,36.27 0 bottom
U$1  62.39,41.04 90 top
U$2  71.28,41.04 90 bottom
U$3  71.28,25 90 bottom
U$4  62.39,25 90 top
U$5  62.39,8.33 90 top
U$6  71.28,8.33 90 bottom
U$7  27.62,25.32 0 top
U$8  10.16,24.37 270 top
U$9  5,27.07 180 bottom
U$10  14.45,45.32 90 top
U$11  5.4,40.4 180 top
U$12  81.76,8.33 90 top
U$13  81.6,25 90 top
U$14  81.76,41.04 90 top
U$15  51.28,8.81 90 bottom
U$16  51.75,24.69 90 bottom
U$17  31.27,12.3 0 bottom
U$18  43.02,12.3 0 bottom
U$19  35.64,6.98 0 top

### Tracks (layer width: path | path; a pad name or v marks a point on that pad's centre or on a via)
+3V3
  Top 0.203: U$10.2 U$10.4 9.45,43.42 C26.A 7.24,43.2 C25.1 4.55,43.1 U$11.2
+5V  (via drill 0.43 pad 0.3)
  Top 0.203: U$19.P$2 40.4,4.45 41.99,6.03 41.99,8.26 40.8,9.45 33.34,9.45 v32.23,10.56
  Top 0.305: JP4.3 JP3.3 JP2.3 17.78,34.85 R14.2 R15.2 21.17,32.84 23.55,35.22 R23.1 24.29,38.44 R24.2 22.7,38.5 C9.A 21.27,41.44 D2.C | D2.C 18.72,47.63 U$10.3 | v29.21,45.8 26.51,45.8 23.97,43.26 D2.C
  Bottom 0.203: v32.23,10.56 32.23,14.29 33.34,15.4 33.34,39.18 L1.1
  Bottom 0.305: L1.1 31.32,43.69 v29.21,45.8 | JP4.3 4.45,35.16 4.13,34.85 U1.3
AGND
  pour Top: 25.4,19.45 25.4,10.4 20.08,10.4 20.08,16.27 8.41,16.27 8.41,20.4 23.34,20.4 23.34,19.45
CAN1_RX  (via drill 0.43 pad 0.3)
  Top 0.203: U$8.61 8.23,27.01 v8.26,26.99 | v5,28.97 v2.86,31.12
  Bottom 0.203: v8.26,26.99 5.79,26.99 5,27.78 v5,28.97 | v2.86,31.12 U1.4
CAN1_TX  (via drill 0.43 pad 0.3)
  Top 0.203: U$8.62 7.74,29.64 10.56,32.46 v10.72,32.46
  Bottom 0.203: U1.1 7.46,32.86 7.54,32.94 10.24,32.94 v10.72,32.46
DC_CAL
  Top 0.203: U$8.43 15.96,25.57 17.3,26.91 20.8,26.91 21.11,26.59 23.44,26.59 U$7.P$12
DGND  (via drill 0.43 pad 0.3)  (3 unrouted)
  Top 0.406: v16.51,29.61 16.19,29.61 | v24.13,40.72 23.65,40.72 | v24.13,45.64 24.13,46.28 | v30.32,35.8 30.32,36.12
  Bottom 0.406: R16.1 v16.51,29.61 | C6.2 24.13,39.82 v24.13,40.72 24.13,41.62 C7.2 | R18.1 24.13,44.31 v24.13,45.64 | D1.P$1 v30.32,35.8
  pour Top: 2.06,48.97 33.18,48.97 33.18,32.31 21.75,32.31 21.75,28.02 2.06,28.02
DVDD
  Bottom 0.203: R17.1 29.27,40.88 R18.2 26.19,43.95
EN_GATE
  Top 0.203: U$7.P$16 17.34,24.57 16.84,25.07 U$8.42
FAULT
  Top 0.203: U$8.44 15.83,26.07 19.21,29.45 19.21,30.4 19.95,31.14 R15.1 21.57,29.57 U$7.P$6
GAIN  (via drill 0.43 pad 0.3)
  Top 0.203: v21.43,27.23 21.78,27.57 U$7.P$10
  Bottom 0.203: JP4.2 11.27,35.64 11.27,34.37 14.61,31.04 14.61,28.5 15.88,27.23 v21.43,27.23
GH_A  (via drill 0.43 pad 0.3)
  Top 0.203: U$7.P$47 34.32,27.57 v34.77,28.02
  Bottom 0.203: v34.77,28.02 34.77,29.29 35.88,30.4 35.88,31.73 R1.1
GH_B  (via drill 0.43 pad 0.3)
  Top 0.203: U$7.P$42 36.66,25.07 v36.91,25.32
  Bottom 0.203: R3.1 36.91,23.6 v36.91,25.32
GH_C  (via drill 0.43 pad 0.3)
  Top 0.203: U$7.P$37 35.13,22.57 v36.04,21.67
  Bottom 0.203: v36.04,21.67 37.09,20.61 R5.1
GL_A
  Top 0.203: U$7.P$45 34.98,26.57 35.64,27.23 R2.1
GL_B
  Top 0.203: U$7.P$40 36.44,24.07 R4.1
GL_C
  Top 0.203: U$7.P$35 34.39,21.57 35.72,20.24 37.68,20.24 R6.1
GND  (via drill 0.43 pad 0.3, 0.61 pad 0.61)  (5 unrouted)
  Top 0.61: v10.08,25.72 v12.7,25.72 | v2.62,24.45 2.38,24.45
  Bottom 0.305: 8.69,27.74 8.73,27.7 | C35.1 6.01,29.92 8.49,29.92 | R35.2 R36.2 R37.2 | U1.2 5.4,32.62 5.95,32.07 8.81,32.07 8.89,32.15
  Bottom 0.406: U$9.2 6.89,28.18 8.41,28.18
  Bottom 0.61: U$9.4 3.11,25.96 2.7,25.96 2.62,25.88 v2.62,24.45 2.62,22.57 R35.2
  other vias: 26.19,22.62 26.19,23.42 27.15,22.62 28.1,22.62 28.1,23.42 29.05,22.62 27.15,23.42 26.19,28.02 29.05,28.02 27.15,28.02 28.1,28.02 26.19,27.23 27.15,27.23 28.1,27.23 29.05,27.23 29.05,23.42 35.88,23.42 39.21,44.85 40.48,44.85 39.21,43.74 40.48,43.74 41.75,44.85 41.75,43.74 50.16,37.07 50.16,36.12 50.16,34.37 50.16,35.32 8.89,12.3 10,12.3
  pour Bottom: 8.26,49.13 84.45,49.13 84.45,0.4 8.26,0.4
  pour Top: 33.66,48.97 33.66,41.2 37.31,41.2 37.31,39.13 47.47,39.13 47.47,33.26 35.24,33.26 35.24,29.61 30.48,29.61 30.48,31.83 24.92,31.83 24.92,19.92 25.88,19.92 25.88,9.92 19.37,9.92 19.37,15.8 7.94,15.8 7.86,27.46 1.98,27.46 2.06,0.4 50.8,0.4 50.8,48.97
H1
  Top 0.203: U$7.P$17 17.2,24.07 16.71,24.57 U$8.41
H1_LOW  (via drill 0.43 pad 0.3)
  Top 0.203: U$7.P$44 35.44,26.07 v35.56,26.19
  Bottom 0.203: U$2.S1 55.24,38.5 54.13,37.39 54.13,31.83 52.92,30.62 R9.2 37.2,30.62 35.82,29.23 R8.2 35.82,26.46 v35.56,26.19 35.24,25.88 35.24,18.65 37.15,16.75 37.15,13.17 U$18.P$3
  Bottom 0.305: U$2.S5 U$2.S4 U$2.S3 U$2.S2 U$2.S1
H1_VS  (via drill 0.43 pad 0.3)  (1 unrouted)
  Top 0.203: v58.26,33.58 48.9,33.58 44.61,29.29 C1.2 38.26,29.23 38.26,28.65 37.78,28.18 35.96,28.18 34.85,27.07 U$7.P$46 30.16,27.07 29.84,27.38 29.84,28.65 29.37,29.13 v28.57,29.13 | R26.1 v20.4,16.91
  Top 0.305: U$1.S5 U$1.S4 U$1.S3 U$1.S2 U$1.S1 | U$14.P$1 79.85,42.31
  Bottom 0.203: v58.26,33.58 59.21,34.53 67.47,34.53 72.55,39.61 U$2.D1 | v20.4,16.91 20.4,23.5 26.04,29.13 v28.57,29.13
  other vias: 79.38,35 79.38,35.96 79.38,36.91 79.38,45.16 79.38,46.12 79.38,47.07 80.64,47.07 81.92,47.07 80.64,46.12 81.92,46.12 80.64,45.16 81.92,45.16 80.64,36.91 81.92,36.91 80.64,35.96 81.92,35.96 80.64,35 81.92,35
  pour Top: 71.6,47.55 82.39,47.55 82.39,34.53 71.6,34.53
H2
  Top 0.203: U$7.P$19 16.93,23.07 16.44,23.57 U$8.39
H2_VS  (via drill 0.43 pad 0.3)  (1 unrouted)
  Top 0.203: R28.1 v17.22,12.78 | v49.85,28.81 46.46,25.42 C2.2 42.2,25.4 38.18,25.4 37.35,24.57 U$7.P$41 31.8,24.53 30.16,24.53 29.84,24.21 29.84,22.15 29.21,21.51 v28.65,21.51
  Top 0.305: U$4.S5 U$4.S4 U$4.S3 U$4.S2 U$4.S1 | U$13.P$1 80.8,23.73
  Bottom 0.203: v49.85,28.81 53.98,28.81 55.56,30.4 67.15,30.4 U$3.D1 | v17.22,12.78 25.96,21.51 v28.65,21.51
  other vias: 79.38,30.88 80.64,30.88 81.92,30.88 79.38,29.92 79.38,28.97 80.64,29.92 80.64,28.97 81.92,29.92 81.92,28.97 79.38,19.92 79.38,18.97 80.64,19.92 81.92,19.92 81.92,18.97 80.64,18.97 79.38,20.88 80.64,20.88 81.92,20.88
  pour Top: 71.6,31.51 82.39,31.51 82.39,18.49 71.6,18.49
H3
  Top 0.203: U$7.P$21 16.66,22.07 16.17,22.57 U$8.37
H3_LOW  (via drill 0.43 pad 0.3)
  Top 0.203: R7.2 42.01,16.59 v39.85,16.59 37.78,16.59 36.2,18.18 36.2,19.13 34.25,21.07 U$7.P$34 30.04,21.07 v28.65,19.69
  Bottom 0.203: U$6.S5 57.42,15.52 56.36,16.59 v39.85,16.59 | U$6.S2 U$6.S1 | U$17.P$3 25.24,13.33 25.24,18.18 26.75,19.69 v28.65,19.69
  Bottom 0.305: U$6.S5 U$6.S4 U$6.S3 U$6.S2
H3_VS  (via drill 0.43 pad 0.3)  (1 unrouted)
  Top 0.203: R30.1 v17.22,10.56 | v59.21,16.11 51.75,16.11 47.36,20.5 C3.2 42.01,20.72 35.88,20.72 34.52,22.07 U$7.P$36 31.76,22.15 30.37,22.15 28.86,20.64 v28.34,20.64
  Top 0.305: U$5.S5 U$5.S4 U$5.S3 | U$5.S1 U$5.S2
  Bottom 0.203: U$6.D1 66.99,8.33 v59.21,16.11 | v17.22,10.56 17.22,11.27 26.59,20.64 v28.34,20.64
  other vias: 79.38,14.37 80.64,14.37 81.92,14.37 79.38,13.41 80.64,13.41 81.92,13.41 79.38,2.3 80.64,2.3 81.92,2.3 79.38,3.25 80.64,3.25 81.92,3.25 79.38,4.21 80.64,4.21 81.92,4.21 79.38,12.46 80.64,12.46 81.92,12.46
  pour Top: 71.6,14.84 82.39,14.84 82.39,1.83 71.6,1.83
L1
  Top 0.203: U$7.P$18 17.07,23.57 16.57,24.07 U$8.40
L2
  Top 0.203: U$7.P$20 16.8,22.57 16.3,23.07 U$8.38
L3
  Top 0.203: U$7.P$22 16.91,21.57 16.77,21.57 16.53,21.57 16.03,22.07 U$8.36
M_OC  (via drill 0.43 pad 0.3)
  Top 0.203: U$7.P$9 20.93,28.07 v20.72,27.86
  Bottom 0.203: JP3.2 15.08,35.8 15.08,28.81 16.03,27.86 v20.72,27.86
M_PWM  (via drill 0.43 pad 0.3)
  Top 0.203: U$7.P$8 20,28.57 v19.92,28.5
  Bottom 0.203: JP2.2 15.56,35.8 15.56,29.13 16.19,28.5 v19.92,28.5
N$1  (via drill 0.61 pad 0.61)
  Top 0.203: U$1.G1 76.2,37.18
  Top 0.61: 76.2,37.18 v76.2,32.46 | v57.31,32.46 v50.96,32.46
  Bottom 0.61: v76.2,32.46 v57.31,32.46 | R1.2 38.31,32.46 v50.96,32.46
N$2  (via drill 0.61 pad 0.61)
  Top 0.61: R2.2 v39.53,27.23
  Bottom 0.203: 42.65,28.92 R9.1
  Bottom 0.61: v39.53,27.23 41.22,28.92 R9.1 | U$2.G1 55.56,37.23 54.93,36.59 54.93,31.35 53.34,29.77 43.5,29.77 42.65,28.92
N$3  (via drill 0.61 pad 0.61)
  Top 0.61: R4.2 38.87,23.81 v42.15,23.81
  Bottom 0.61: R8.1 41.41,23.81 v42.15,23.81 46.28,23.81 49.21,20.88 57.11,20.88 U$3.G1
N$4  (via drill 0.61 pad 0.61)
  Top 0.61: U$4.G1 72.43,17.38 v64.77,17.38
  Bottom 0.61: v64.77,17.38 50.48,17.38 45.4,22.46 39.74,22.46 R3.2
N$5  (via drill 0.61 pad 0.61)
  Top 0.61: U$5.G1 76.24,2.51 74.77,1.03 50.32,1.03 46.51,4.84 v46.51,19.13
  Bottom 0.61: R5.2 v46.51,19.13
N$6  (via drill 0.61 pad 0.61)
  Top 0.203: 42.17,18.02 R7.1 42.28,18.02
  Top 0.61: R6.2 37.09,18.39 37.47,18.02 42.17,18.02 | v45.09,6.91 45.09,17.22 44.29,18.02 42.28,18.02
  Bottom 0.61: U$6.G1 56.47,3.57 48.42,3.57 v45.09,6.91
N$7
  Top 0.203: U$7.P$48 33.87,28.07 35.08,29.29 C1.1
N$8  (via drill 0.43 pad 0.3)
  Top 0.203: U$7.P$11 25.09,27.07 25.4,27.38 25.4,30 v25.72,30.32
  Bottom 0.203: R17.2 27.57,32.17 v25.72,30.32
N$9  (via drill 0.43 pad 0.3)
  Top 0.203: R10.2 39.74,12.3 v41.12,12.3
  Bottom 0.203: 38.2,15.54 U$18.P$1 39.62,15.54 41.12,14.05 v41.12,12.3
N$10
  Top 0.203: U$7.P$14 19.73,25.57 C8.1
N$11
  Top 0.203: U$7.P$30 33.71,19.07 34.29,18.49 34.29,17.86 33.18,16.75 32.96,16.75 C5.2 32.54,16.33 R13.1
N$12
  Top 0.203: C2.1 41.81,27.12 40.8,26.11 36.59,26.11 36.05,25.57 U$7.P$43
N$13
  Top 0.203: U$7.P$15 18.35,25.07 17.72,25.69 C8.2 17.94,25.9
N$14
  Bottom 0.203: R20.1 28.31,39.77 C7.1
N$15
  Top 0.203: R21.2 26.41,32.46 24.13,32.46 23.74,32.07 U$7.P$1
N$16  (via drill 0.43 pad 0.3)
  Top 0.203: U$7.P$7 20.54,29.07 v20,29.61
  Bottom 0.203: R16.2 v20,29.61
N$17
  Top 0.203: U$7.P$55 30.1,31.57 29.53,32.15 29.53,33.79 R25.2
N$18  (via drill 0.43 pad 0.3)
  Top 0.203: U$7.P$13 20.68,26.07 v20.56,26.19
  Bottom 0.203: C15.1 19.58,26.27 19.66,26.19 v20.56,26.19
N$19  (via drill 0.43 pad 0.3)
  Top 0.203: U$7.P$50 U$7.P$51 34.09,29.57 34.92,30.4 34.92,34.05 v34.77,34.21
  Bottom 0.203: 36.62,35.8 D1.P$2 35.13,34.57 v34.77,34.21 | 36.62,35.8 C10.2 | 36.62,35.8 L1.2
N$20  (via drill 0.43 pad 0.3)
  Top 0.203: U$7.P$2 25.46,31.57 v25.72,31.83
  Bottom 0.203: v25.72,31.83 26.61,32.73 R20.2 26.61,39.4 C6.1
N$21
  Top 0.203: U$7.P$49 33.73,28.57 35.4,30.24 35.4,35.06 R19.2
N$22
  Top 0.203: R10.1 C4.1 35.72,14.58 35.72,18.97 34.12,20.57 U$7.P$33
N$23
  Top 0.203: U$7.P$32 33.98,20.07 35.24,18.81 35.24,13.36 C4.2 37.41,11.19 42.28,11.19 R11.1
N$24
  Top 0.203: R12.1 C5.1 34.77,16.85 34.77,18.65 33.85,19.57 U$7.P$31
N$25  (via drill 0.43 pad 0.3)
  Top 0.203: R12.2 32.65,14.42 v31.59,15.48
  Bottom 0.203: v31.59,15.48 27.22,15.48 U$17.P$1
N$26
  Top 0.203: U$7.P$38 35.27,23.07 35.88,22.46 41.97,22.46 C3.1
N$27
  Top 0.203: U$7.P$27 25.3,19.07 25.72,18.65 25.72,17.17 C16.1
N$28
  Top 0.203: R24.1 27.84,36.59 R22.2 28.73,35.38 28.73,32.31 27.5,31.07 U$7.P$3
N$29  (via drill 0.43 pad 0.3)
  Top 0.203: v34.29,30.72 34.29,30.4 33.96,30.07 U$7.P$52
  Bottom 0.203: C10.1 36.46,33.73 35.88,33.73 34.29,32.15 v34.29,30.72
N$30
  Top 0.203: C17.1 C18.1 26.67,16.06 26.67,19.45 25.05,21.07 U$7.P$23
N$31  (via drill 0.43 pad 0.3)
  Top 0.203: R13.2 30.48,14.31 30.48,13.34 31.04,12.78 v32.94,12.78
  Bottom 0.203: U$17.P$2 34.27,15.54 32.94,14.21 v32.94,12.78
N$32  (via drill 0.43 pad 0.3)
  Top 0.203: U$8.19 7.74,18.14 v8.33,17.54
  Bottom 0.203: C28.1 9.11,16.77 v8.33,17.54
N$33  (via drill 0.43 pad 0.3)
  Top 0.203: R11.2 42.97,13.89 v41.91,13.89
  Bottom 0.203: U$18.P$2 43.56,15.54 v41.91,13.89
N$34  (via drill 0.43 pad 0.3)
  Top 0.203: U$8.32 14.99,19.69 v15.24,19.45
  Bottom 0.203: v15.24,19.45 C29.1
N$35  (via drill 0.43 pad 0.3)
  Top 0.203: U$8.48 13.38,28.07 v12.7,27.38
  Bottom 0.203: C30.1 12.7,28.39 v12.7,27.38
N$36  (via drill 0.43 pad 0.3)
  Top 0.203: 6.7,28.94 U$8.64 6.62,28.94 4.76,30.8 v4.76,31.51
  Bottom 0.203: 7.25,30.88 C31.1 7.09,31.51 v4.76,31.51
N$37  (via drill 0.43 pad 0.3)
  Top 0.203: U$8.13 6.51,22.07 6.99,21.59 v8.18,21.59
  Bottom 0.203: C32.1 8.18,20.85 v8.18,21.59
N$38  (via drill 0.43 pad 0.3)
  Top 0.203: U$8.31 13.73,20.95 v13.65,21.03
  Bottom 0.203: v13.65,21.03 13.65,18.55 C33.1
N$39  (via drill 0.43 pad 0.3)
  Top 0.203: U$8.47 13.99,27.57 v13.81,27.38
  Bottom 0.203: v13.81,27.38 13.81,26.06 C34.1
N$40  (via drill 0.43 pad 0.3)
  Top 0.203: U$8.5 5.21,26.07 4.52,26.75 v4.52,27.07
  Bottom 0.203: v4.52,27.07 3.37,28.22 U$9.1 3.37,28.22 3.73,28.58 3.73,29.82 C35.2
N$41  (via drill 0.43 pad 0.3)
  Top 0.203: U$8.6 8.03,25.57 v8.33,25.88
  Bottom 0.203: U$9.3 8.29,25.92 v8.33,25.88 8.33,24.5 C36.2
N$42
  Bottom 0.203: U1.8 6.67,42.2 R33.1
N$43  (via drill 0.43 pad 0.3)
  Top 0.203: v33.02,7.78 34.13,8.89 36.04,8.89 37.68,7.25 U$19.P$3
  Bottom 0.203: R34.1 5.4,42.57 U1.7 5.4,38.02 4.05,36.67 1.98,36.67 1.11,35.8 1.11,1.43 1.75,0.79 26.04,0.79 v33.02,7.78
N$44
  Bottom 0.203: R34.2 4.13,42.73 U1.6 4.13,37.7 3.65,37.23 1.51,37.23 0.64,36.35 0.64,0.95 1.19,0.4 26.35,0.4 32.94,6.99 U$19.P$5
N$45  (via drill 0.43 pad 0.3)
  Top 0.203: v6.99,24.84 6.71,24.57 U$8.8
  Bottom 0.203: D3.A 6.67,24.53 v6.99,24.84
N$46  (via drill 0.43 pad 0.3)
  Top 0.203: U$8.9 5.02,24.07 v4.68,23.73
  Bottom 0.203: 6.12,23.02 D4.A 5.56,23.34 5.08,23.34 v4.68,23.73
N$47  (via drill 0.43 pad 0.3)
  Top 0.203: U$8.10 7.07,23.57 v7.78,22.86
  Bottom 0.203: 5.88,19.85 D5.A 6.67,20.4 6.67,22.3 7.22,22.86 v7.78,22.86
N$48  (via drill 0.43 pad 0.3)
  Top 0.203: U$8.11 6.54,23.07 7.38,22.23 v9.05,22.23
  Bottom 0.203: D6.A 7.06,18.26 7.06,21.67 7.62,22.23 v9.05,22.23
N$49
  Bottom 0.203: D6.C 7.62,15.95 7.62,14.63 R38.1
N$50
  Bottom 0.203: 5.79,18.1 D5.C 5.47,18.1 R37.1
N$51
  Bottom 0.203: D4.C 5.64,21.03 4.74,21.03 R36.1
N$52
  Bottom 0.203: D3.C 4.05,24.29 4.05,22.84 R35.1
NRST
  Top 0.203: U$8.7 5.17,25.07 4.6,25.64 3.04,25.64 C37.1 | C37.1 3.39,25.64 3.41,25.62 | C37.1 3.41,25.26 3.41,17.38 3.17,17.15 3.17,12.94 3.81,12.3 SV1.5
OCTW
  Top 0.203: R14.1 18.63,31.99 20.64,31.99 21.11,31.51 21.11,30.56 21.6,30.07 U$7.P$5 | 17.46,30.82 R14.1 | U$8.45 15.77,26.57 17.3,28.1 17.3,30.66 17.36,30.72 | 17.3,30.72 17.36,30.72 | 17.36,30.72 R14.1
PWRGD  (via drill 0.43 pad 0.3)
  Top 0.203: U$7.P$4 21.9,30.57 21.59,30.88 21.59,32.31 v22.86,33.58 24.23,33.58 R23.2 | U$8.51 13.23,31.57 15.24,33.58 v16.19,33.58
  Bottom 0.203: v16.19,33.58 v22.86,33.58
REF
  Top 0.203: U$7.P$24 17.62,20.57 17.13,20.57 16.89,20.57 15.9,21.57 U$8.35
RX  (via drill 0.43 pad 0.3)
  Top 0.203: U$8.59 9.23,28.13 8.97,27.86 8.97,24.61 10.24,23.34 v13.81,23.34
  Bottom 0.203: JP1.3 8.97,7.38 17.54,15.95 17.54,19.61 v13.81,23.34
SENS1
  Top 0.203: U$8.21 8.73,18.65 9.37,18.02 13.94,18.02 R27.2 16.49,16.95 R26.2
SENS2
  Top 0.203: R28.2 13.49,13.13 13.49,16.83 13.21,17.11 R29.2 11.56,17.54 9.29,17.54 8.23,18.59 U$8.20
SENS3
  Top 0.203: R31.2 9.87,16.24 10.56,15.56 10.56,13.84 R30.2 | R31.2 8.84,16.24 | U$8.17 6.74,17.95 8.49,16.19 9.08,16.19 R31.2
SO1
  Top 0.203: U$7.P$25 16.84,20.07 15.84,21.07 U$8.34
SO2
  Top 0.203: U$7.P$26 16.78,19.57 15.79,20.57 U$8.33
SWCLK  (via drill 0.43 pad 0.3)
  Top 0.203: v13.97,30.56 14.23,30.29 U$8.49 | SV1.2 7.38,6.83 7.38,10.64 8.1,11.35 v11.27,11.35
  Bottom 0.203: v13.97,30.56 12.38,30.56 11.59,29.77 11.59,11.67 v11.27,11.35
SWDIO  (via drill 0.43 pad 0.3)
  Top 0.203: U$8.46 14.45,27.07 14.05,26.67 v10.95,26.67
  Bottom 0.203: v10.95,26.67 10.95,11.99 10.48,11.51 6.99,11.51 SV1.4
TEMP
  Top 0.203: U$11.1 6.83,39.82 6.83,35.96 6.29,35.42 C27.1 7.33,33.5 7.38,33.5 | U$8.52 12.7,28.98 12.7,31.99 11.19,33.5 7.38,33.5 | 7.38,33.5 R32.1
TX  (via drill 0.43 pad 0.3)
  Top 0.203: U$8.58 9.73,27.91 9.37,27.54 9.37,24.84 10.08,24.13 v12.7,24.13
  Bottom 0.203: JP1.4 10.87,9.92 16.99,16.03 16.99,19.61 14.05,22.54 13.57,22.54 12.7,23.42 v12.7,24.13
VCC  (via drill 0.43 pad 0.3)  (8 unrouted)
  Top 0.203: U$7.P$54 U$7.P$53 30.33,30.57 29.84,30.08 v29.84,29.61 | v29.84,19.92 29.84,18.97 30.25,18.57 U$7.P$29 31.84,17.95 31.43,17.54 29.21,17.54 28.57,16.91 28.57,10.56 v26.04,8.02
  Top 0.813: U$5.D1 U$4.D1 U$1.D1 58.26,38.18 45.88,38.18
  Bottom 0.203: v29.84,29.61 v29.84,19.92 | 23.19,8.98 C24.2 23.5,8.02 v26.04,8.02 | SV1.1 8.73,2.14 JP1.1 15.57,8.98 C22.2
  Bottom 0.305: C22.2 C24.2
  other vias: 51.91,11.51 53.02,10.4 51.91,9.13 53.02,8.18 51.91,7.06 53.02,6.11
  pour Top: 37.62,33.73 46.99,33.73 46.99,38.66 36.83,38.66 36.83,40.72 33.66,40.72 33.66,31.67 31.27,31.67 31.27,30.08 34.77,30.08 34.77,37.07 37.62,37.07

### Text on the board
tNames: GND | PWRCAPS | OC | GAIN | PWM | VCC | * | * | * | * | TX | RX | GND | VCC | GND | VCC | VCC | PWRCAPS
bNames: IND